# Altium schematic sheet PortaPill_MainBoard.SchDoc
size A3; DrawnBy: So-Ra Chung; SheetNumber: 1; SheetTotal: 1
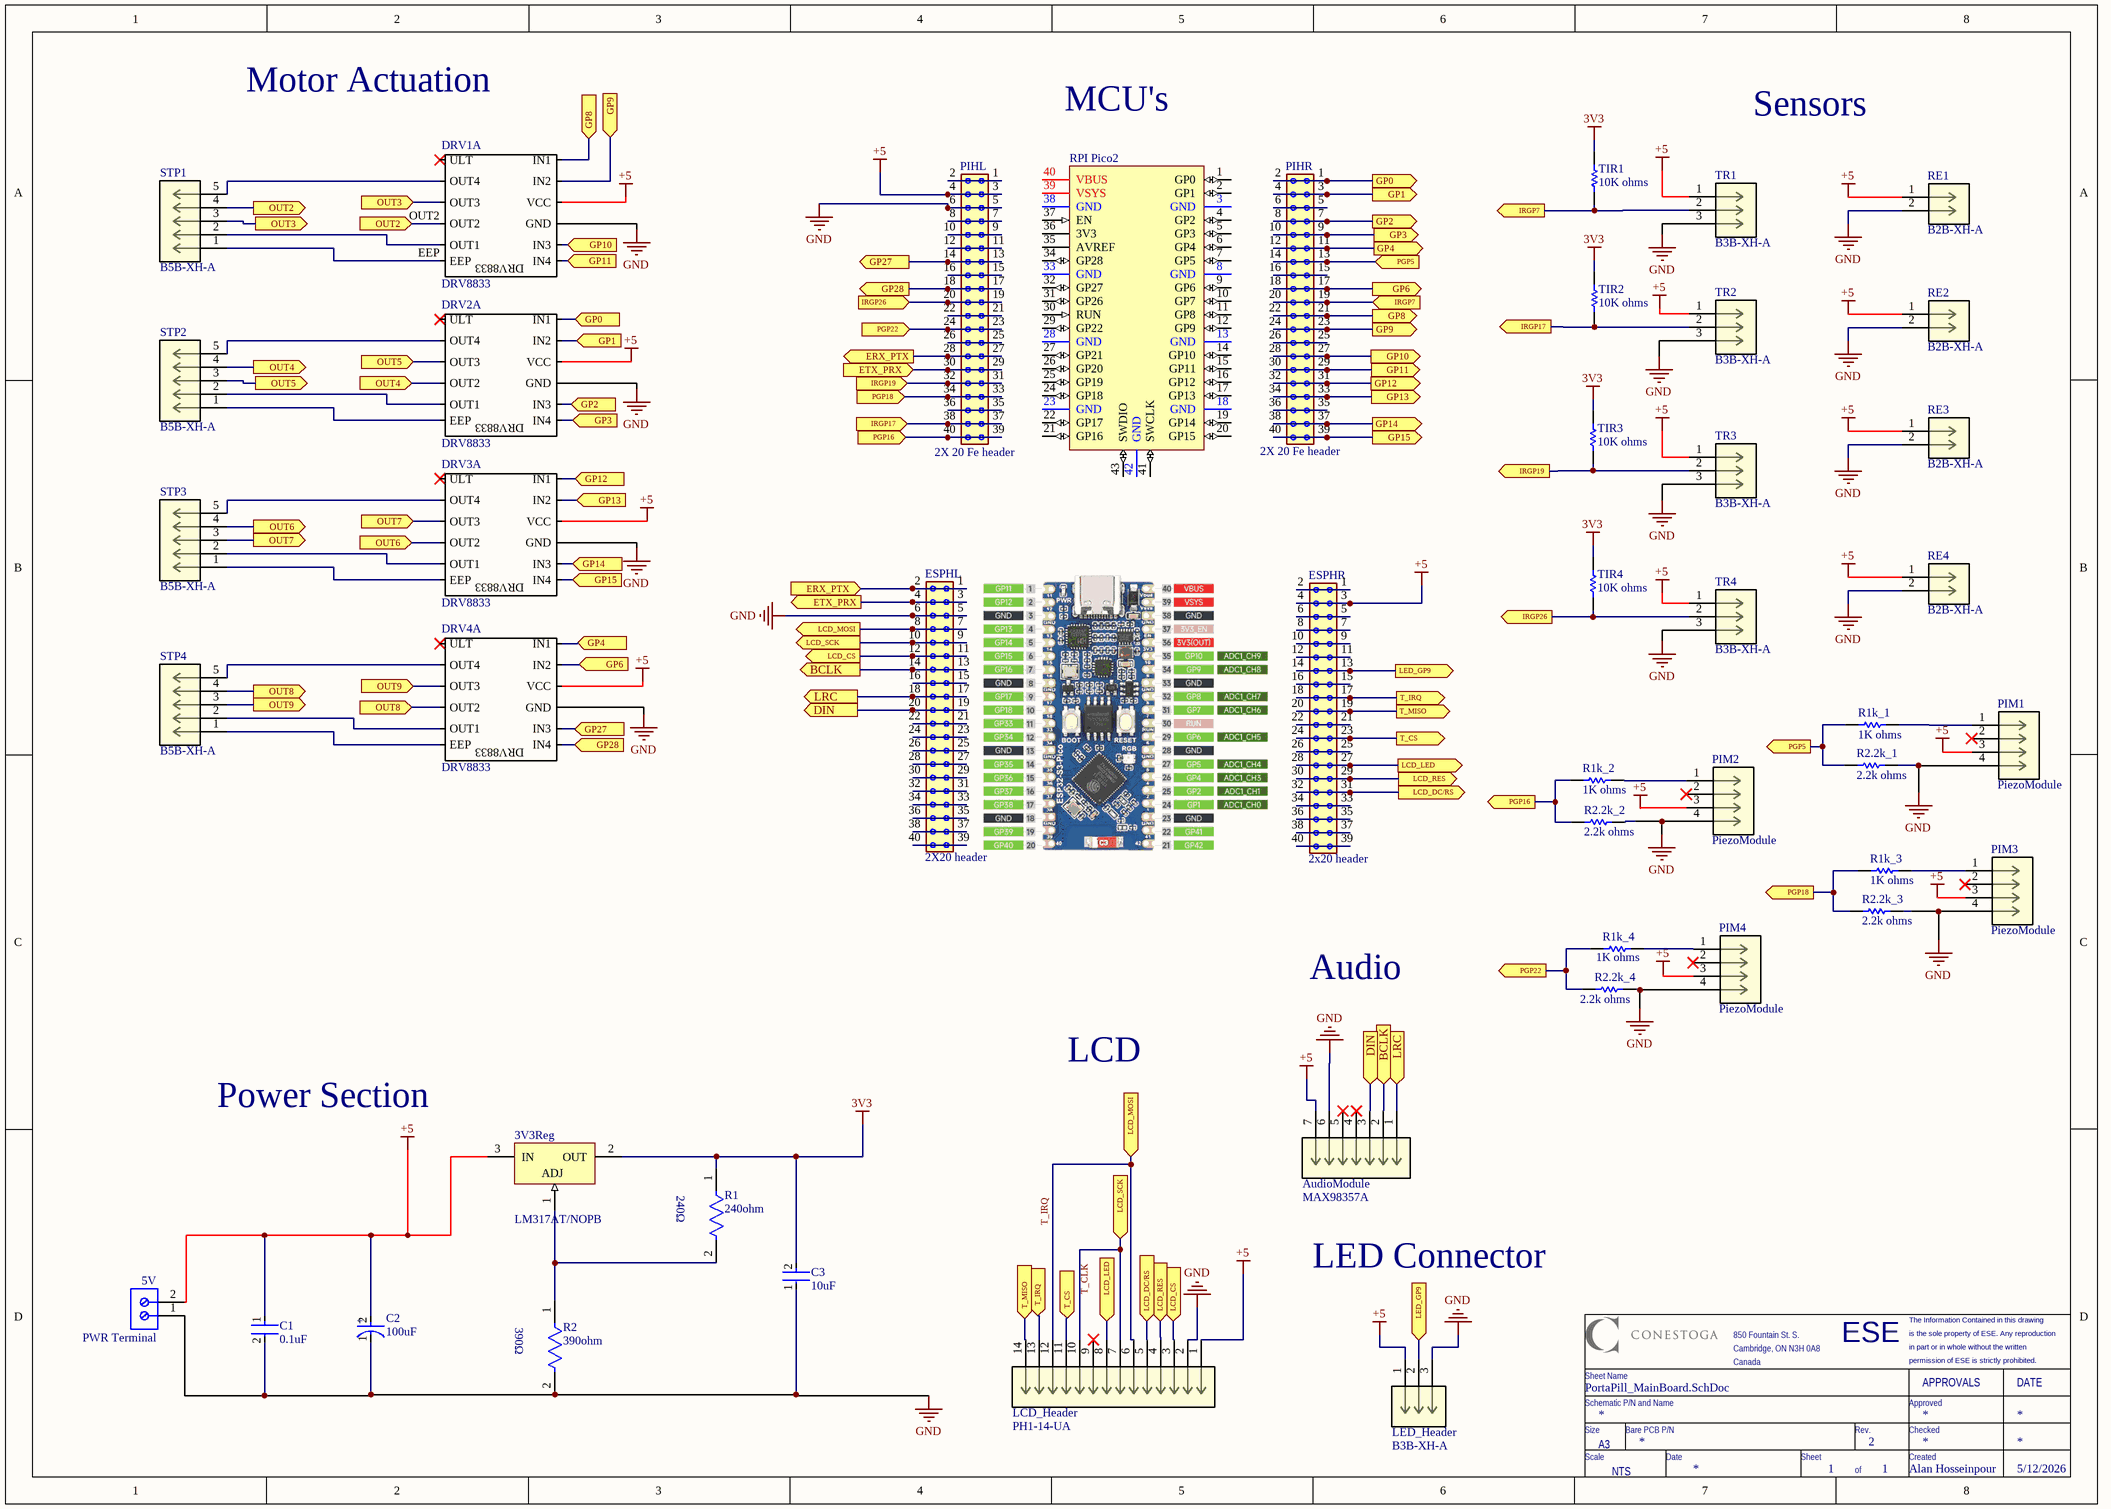
[diagram p0: PortaPill_MainBoard.SchDoc]

## Parts
3V3Reg  LM317AT/NOPB  [NDE0003A]
AudioModule  MAX98357A  [CONN07_901471107_MOL]
C1  0.1uF  [FP-C410C104M5U5TA7200-MFG]
C2  100uF  [FP-RAD-TH-D_12_5_0_5-L_25-MFG]
C3  10uF  [FP-DE2_D15_T5_F7_5_d0_6-0-MFG]
DRV1  DRV8833  [DRV8833]  (part A of 3)
DRV2  DRV8833  [DRV8833]  (part A of 3)
DRV3  DRV8833  [DRV8833]  (part A of 3)
DRV4  DRV8833  [DRV8833]  (part A of 3)
ESPHL  2X20 header  [61304021821]
ESPHR  2x20 header  [61304021821]
LCD_Header  PH1-14-UA  [CONN_PH1-14-UA_ADM]
LED_Header  B3B-XH-A  [CONN_B3B-XH-A_JST]
PIHL  2X 20 Fe header  [61304021821]
PIHR  2X 20 Fe header  [61304021821]
PIM1  PiezoModule  [CONN_PPTC041LFBN-RC_SUL]
PIM2  PiezoModule  [CONN_PPTC041LFBN-RC_SUL]
PIM3  PiezoModule  [CONN_PPTC041LFBN-RC_SUL]
PIM4  PiezoModule  [CONN_PPTC041LFBN-RC_SUL]
PWR_Terminal  5V  [691216400002]
R1  240ohm  [RR02_MFG]
R1k_1  1K ohms  [RESA60-630X240]
R1k_2  1K ohms  [RESA60-630X240]
R1k_3  1K ohms  [RESA60-630X240]
R1k_4  1K ohms  [RESA60-630X240]
R2  390ohm  [RR02_MFG]
R2.2k_1  2.2k ohms  [RESA60-630X240]
R2.2k_2  2.2k ohms  [RESA60-630X240]
R2.2k_3  2.2k ohms  [RESA60-630X240]
R2.2k_4  2.2k ohms  [RESA60-630X240]
RE1  B2B-XH-A  [CONN_B2B-XH-A_JST]
RE2  B2B-XH-A  [CONN_B2B-XH-A_JST]
RE3  B2B-XH-A  [CONN_B2B-XH-A_JST]
RE4  B2B-XH-A  [CONN_B2B-XH-A_JST]
RPI_Pico2  RPI-PICO-MOD_SM  [RPI-PICO-MOD]  (value not drawn)
STP1  B5B-XH-A  [CONN_B5B-XH-A_JST]
STP2  B5B-XH-A  [CONN_B5B-XH-A_JST]
STP3  B5B-XH-A  [CONN_B5B-XH-A_JST]
STP4  B5B-XH-A  [CONN_B5B-XH-A_JST]
TIR1  10K ohms  [RESA60-630X240]
TIR2  10K ohms  [RESA60-630X240]
TIR3  10K ohms  [RESA60-630X240]
TIR4  10K ohms  [RESA60-630X240]
TR1  B3B-XH-A  [CONN_B3B-XH-A_JST]
TR2  B3B-XH-A  [CONN_B3B-XH-A_JST]
TR3  B3B-XH-A  [CONN_B3B-XH-A_JST]
TR4  B3B-XH-A  [CONN_B3B-XH-A_JST]

## Ports
BCLK (in, see PortaPill_MainBoard[4B]), BCLK (out, see PortaPill_MainBoard[6C]), DIN (in, see PortaPill_MainBoard[4B]), DIN (out, see PortaPill_MainBoard[6C]), ERX_PTX (in, see PortaPill_MainBoard[4A]), ERX_PTX (out, see PortaPill_MainBoard[4B]), ETX_PRX (in, see PortaPill_MainBoard[4B]), ETX_PRX (out, see PortaPill_MainBoard[4A]), GP0 (in, see PortaPill_MainBoard[6A]), GP0 (out, see PortaPill_MainBoard[3A]), GP1 (in, see PortaPill_MainBoard[6A]), GP1 (out, see PortaPill_MainBoard[3A]), GP2 (in, see PortaPill_MainBoard[6A]), GP2 (out, see PortaPill_MainBoard[3B]), GP3 (in, see PortaPill_MainBoard[6A]), GP3 (out, see PortaPill_MainBoard[3B]), GP4 (in, see PortaPill_MainBoard[6A]), GP4 (out, see PortaPill_MainBoard[3B]), GP6 (in, see PortaPill_MainBoard[6A]), GP6 (out, see PortaPill_MainBoard[3B]), GP8 (in, see PortaPill_MainBoard[6A]), GP8 (out, see PortaPill_MainBoard[3A]), GP9 (in, see PortaPill_MainBoard[6A]), GP9 (out, see PortaPill_MainBoard[3A]), GP10 (in, see PortaPill_MainBoard[6A]), GP10 (out, see PortaPill_MainBoard[3A]), GP11 (in, see PortaPill_MainBoard[6A]), GP11 (out, see PortaPill_MainBoard[3A]), GP12 (in, see PortaPill_MainBoard[6B]), GP12 (out, see PortaPill_MainBoard[3B]), GP13 (in, see PortaPill_MainBoard[6B]), GP13 (out, see PortaPill_MainBoard[3B]), GP14 (in, see PortaPill_MainBoard[6B]), GP14 (out, see PortaPill_MainBoard[3B]), GP15 (in, see PortaPill_MainBoard[6B]), GP15 (out, see PortaPill_MainBoard[3B]), GP27 (in, see PortaPill_MainBoard[4A]), GP27 (out, see PortaPill_MainBoard[3B]), GP28 (in, see PortaPill_MainBoard[4A]), GP28 (out, see PortaPill_MainBoard[3B]), IRGP7 (in, see PortaPill_MainBoard[6A]), IRGP7 (out, see PortaPill_MainBoard[6A]), IRGP17 (in, see PortaPill_MainBoard[6A]), IRGP17 (out, see PortaPill_MainBoard[4B]), IRGP19 (in, see PortaPill_MainBoard[6B]), IRGP19 (out, see PortaPill_MainBoard[4B]), IRGP26 (in, see PortaPill_MainBoard[6B]), IRGP26 (out, see PortaPill_MainBoard[4A]), LCD_CS (in, see PortaPill_MainBoard[4B]), LCD_CS (out, see PortaPill_MainBoard[5D]), LCD_DC/RS (in, see PortaPill_MainBoard[6C]), LCD_DC/RS (out, see PortaPill_MainBoard[5D]), LCD_LED (in, see PortaPill_MainBoard[6C]), LCD_LED (out, see PortaPill_MainBoard[5D]), LCD_MOSI (in, see PortaPill_MainBoard[4B]), LCD_MOSI (out, see PortaPill_MainBoard[5D]), LCD_RES (in, see PortaPill_MainBoard[6C]), LCD_RES (out, see PortaPill_MainBoard[5D]), LCD_SCK (in, see PortaPill_MainBoard[4B]), LCD_SCK (out, see PortaPill_MainBoard[5D]), LED_GP9 (in, see PortaPill_MainBoard[6B]), LED_GP9 (out, see PortaPill_MainBoard[6D]), LRC (in, see PortaPill_MainBoard[4B]), LRC (out, see PortaPill_MainBoard[6C]), OUT2 (in, see PortaPill_MainBoard[1A]), OUT2 (out, see PortaPill_MainBoard[2A]), OUT3 (in, see PortaPill_MainBoard[1A]), OUT3 (out, see PortaPill_MainBoard[2A]), OUT4 (in, see PortaPill_MainBoard[1A]), OUT4 (out, see PortaPill_MainBoard[2B]), OUT5 (in, see PortaPill_MainBoard[1B]), OUT5 (out, see PortaPill_MainBoard[2A]), OUT6 (in, see PortaPill_MainBoard[1B]), OUT6 (out, see PortaPill_MainBoard[2B]), OUT7 (in, see PortaPill_MainBoard[1B]), OUT7 (out, see PortaPill_MainBoard[2B]), OUT8 (in, see PortaPill_MainBoard[1B]), OUT8 (out, see PortaPill_MainBoard[2B]), OUT9 (in, see PortaPill_MainBoard[1B]), OUT9 (out, see PortaPill_MainBoard[2B]), PGP5 (in, see PortaPill_MainBoard[7B]), PGP5 (out, see PortaPill_MainBoard[6A]), PGP16 (in, see PortaPill_MainBoard[6C]), PGP16 (out, see PortaPill_MainBoard[4B]), PGP18 (in, see PortaPill_MainBoard[7C]), PGP18 (out, see PortaPill_MainBoard[4B]), PGP22 (in, see PortaPill_MainBoard[6C]), PGP22 (out, see PortaPill_MainBoard[4A]), T_CS (in, see PortaPill_MainBoard[6B]), T_CS (out, see PortaPill_MainBoard[5D]), T_IRQ (in, see PortaPill_MainBoard[6B]), T_IRQ (out, see PortaPill_MainBoard[4D]), T_MISO (in, see PortaPill_MainBoard[6B]), T_MISO (out, see PortaPill_MainBoard[4D])

## Nets
3V3: 3V3Reg.2(OUT) C3.2 R1.1 TIR1.2 TIR2.2 TIR3.2 TIR4.2
+5: 3V3Reg.3(IN) AudioModule.7 C1.1 C2.2(A) DRV1.VCC DRV2.VCC DRV3.VCC DRV4.VCC ESPHR.3 ESPHR.4 LCD_Header.1 LED_Header.1 PIHL.3 PIHL.4 PIM1.3 PIM2.3 PIM3.3 PIM4.3 PWR_Terminal.2 RE1.1 RE2.1 RE3.1 RE4.1 TR1.1 TR2.1 TR3.1 TR4.1
GND: AudioModule.6 C1.2 C2.1(C) C3.1 DRV1.GND DRV2.GND DRV3.GND DRV4.GND ESPHL.5 ESPHL.6 LCD_Header.2 LED_Header.3 PIHL.5 PIHL.6 PIM1.4 PIM2.4 PIM3.4 PIM4.4 PWR_Terminal.1 R2.2 R2.2k_1.2 R2.2k_2.2 R2.2k_3.2 R2.2k_4.2 RE1.2 RE2.2 RE3.2 RE4.2 TR1.3 TR2.3 TR3.3 TR4.3
BCLK: AudioModule.2 ESPHL.13 ESPHL.14 ; port BCLK
DIN: AudioModule.3 ESPHL.19 ESPHL.20 ; port DIN
ERX_PTX: ESPHL.1 ESPHL.2 PIHL.27 PIHL.28 ; port ERX_PTX
ETX_PRX: ESPHL.3 ESPHL.4 PIHL.29 PIHL.30 ; port ETX_PRX
GP0: DRV2.IN1 PIHR.1 PIHR.2 ; port GP0
GP1: DRV2.IN2 PIHR.3 PIHR.4 ; port GP1
GP2: DRV2.IN3 PIHR.7 PIHR.8 ; port GP2
GP3: DRV2.IN4 PIHR.9 PIHR.10 ; port GP3
GP4: DRV4.IN1 PIHR.11 PIHR.12 ; port GP4
GP6: DRV4.IN2 PIHR.17 PIHR.18 ; port GP6
GP8: DRV1.IN1 PIHR.21 PIHR.22 ; port GP8
GP9: DRV1.IN2 PIHR.23 PIHR.24 ; port GP9
GP10: DRV1.IN3 PIHR.27 PIHR.28 ; port GP10
GP11: DRV1.IN4 PIHR.29 PIHR.30 ; port GP11
GP12: DRV3.IN1 PIHR.31 PIHR.32 ; port GP12
GP13: DRV3.IN2 PIHR.33 PIHR.34 ; port GP13
GP14: DRV3.IN3 PIHR.37 PIHR.38 ; port GP14
GP15: DRV3.IN4 PIHR.39 PIHR.40 ; port GP15
GP27: DRV4.IN3 PIHL.13 PIHL.14 ; port GP27
GP28: DRV4.IN4 PIHL.17 PIHL.18 ; port GP28
IRGP7: PIHR.19 PIHR.20 TIR1.1 TR1.2 ; port IRGP7
IRGP17: PIHL.37 PIHL.38 TIR2.1 TR2.2 ; port IRGP17
IRGP19: PIHL.31 PIHL.32 TIR3.1 TR3.2 ; port IRGP19
IRGP26: PIHL.19 PIHL.20 TIR4.1 TR4.2 ; port IRGP26
LCD_CS: ESPHL.11 ESPHL.12 LCD_Header.3 ; port LCD_CS
LCD_DC/RS: ESPHR.31 ESPHR.32 LCD_Header.5 ; port LCD_DC/RS
LCD_LED: ESPHR.27 ESPHR.28 LCD_Header.8 ; port LCD_LED
LCD_MOSI: ESPHL.7 ESPHL.8 LCD_Header.6 LCD_Header.12 ; port LCD_MOSI
LCD_RES: ESPHR.29 ESPHR.30 LCD_Header.4 ; port LCD_RES
LCD_SCK: ESPHL.9 ESPHL.10 LCD_Header.7 LCD_Header.10 ; port LCD_SCK
LED_GP9: ESPHR.13 ESPHR.14 LED_Header.2 ; port LED_GP9
LRC: AudioModule.1 ESPHL.17 ESPHL.18 ; port LRC
OUT2: DRV1.OUT2 STP1.4 ; port OUT2
OUT3: DRV1.OUT3 STP1.3 ; port OUT3
OUT4: DRV2.OUT2 STP2.4 ; port OUT4
OUT5: DRV2.OUT3 STP2.3 ; port OUT5
OUT6: DRV3.OUT2 STP3.4 ; port OUT6
OUT7: DRV3.OUT3 STP3.3 ; port OUT7
OUT8: DRV4.OUT2 STP4.4 ; port OUT8
OUT9: DRV4.OUT3 STP4.3 ; port OUT9
PGP5: PIHR.13 PIHR.14 R1k_1.1 R2.2k_1.1 ; port PGP5
PGP16: PIHL.39 PIHL.40 R1k_2.1 R2.2k_2.1 ; port PGP16
PGP18: PIHL.33 PIHL.34 R1k_3.1 R2.2k_3.1 ; port PGP18
PGP22: PIHL.23 PIHL.24 R1k_4.1 R2.2k_4.1 ; port PGP22
T_CS: ESPHR.23 ESPHR.24 LCD_Header.11 ; port T_CS
T_IRQ: ESPHR.17 ESPHR.18 LCD_Header.13 ; port T_IRQ
T_MISO: ESPHR.19 ESPHR.20 LCD_Header.14 ; port T_MISO
Net3V3Reg_1: 3V3Reg.1(ADJ) R1.2 R2.1
NetDRV1_EEP: DRV1.EEP STP1.1
NetDRV1_OUT1: DRV1.OUT1 STP1.2
NetDRV1_OUT4: DRV1.OUT4 STP1.5
NetDRV2_EEP: DRV2.EEP STP2.1
NetDRV2_OUT1: DRV2.OUT1 STP2.2
NetDRV2_OUT4: DRV2.OUT4 STP2.5
NetDRV3_EEP: DRV3.EEP STP3.1
NetDRV3_OUT1: DRV3.OUT1 STP3.2
NetDRV3_OUT4: DRV3.OUT4 STP3.5
NetDRV4_EEP: DRV4.EEP STP4.1
NetDRV4_OUT1: DRV4.OUT1 STP4.2
NetDRV4_OUT4: DRV4.OUT4 STP4.5
NetESPHL_15: ESPHL.15 ESPHL.16
NetESPHL_21: ESPHL.21 ESPHL.22
NetESPHL_23: ESPHL.23 ESPHL.24
NetESPHL_25: ESPHL.25 ESPHL.26
NetESPHL_27: ESPHL.27 ESPHL.28
NetESPHL_29: ESPHL.29 ESPHL.30
NetESPHL_31: ESPHL.31 ESPHL.32
NetESPHL_33: ESPHL.33 ESPHL.34
NetESPHL_35: ESPHL.35 ESPHL.36
NetESPHL_37: ESPHL.37 ESPHL.38
NetESPHL_39: ESPHL.39 ESPHL.40
NetESPHR_1: ESPHR.1 ESPHR.2
NetESPHR_5: ESPHR.5 ESPHR.6
NetESPHR_7: ESPHR.7 ESPHR.8
NetESPHR_9: ESPHR.9 ESPHR.10
NetESPHR_11: ESPHR.11 ESPHR.12
NetESPHR_15: ESPHR.15 ESPHR.16
NetESPHR_21: ESPHR.21 ESPHR.22
NetESPHR_25: ESPHR.25 ESPHR.26
NetESPHR_33: ESPHR.33 ESPHR.34
NetESPHR_35: ESPHR.35 ESPHR.36
NetESPHR_37: ESPHR.37 ESPHR.38
NetESPHR_39: ESPHR.39 ESPHR.40
NetPIHL_1: PIHL.1 PIHL.2
NetPIHL_7: PIHL.7 PIHL.8
NetPIHL_9: PIHL.9 PIHL.10
NetPIHL_11: PIHL.11 PIHL.12
NetPIHL_15: PIHL.15 PIHL.16
NetPIHL_21: PIHL.21 PIHL.22
NetPIHL_25: PIHL.25 PIHL.26
NetPIHL_35: PIHL.35 PIHL.36
NetPIHR_5: PIHR.5 PIHR.6
NetPIHR_15: PIHR.15 PIHR.16
NetPIHR_25: PIHR.25 PIHR.26
NetPIHR_35: PIHR.35 PIHR.36
NetPIM1_1: PIM1.1 R1k_1.2
NetPIM2_1: PIM2.1 R1k_2.2
NetPIM3_1: PIM3.1 R1k_3.2
NetPIM4_1: PIM4.1 R1k_4.2

Not connected (* = marked no-connect by the designer): AudioModule 4* 5*; DRV1 ULT*; DRV2 ULT*; DRV3 ULT*; DRV4 ULT*; LCD_Header 9*; PIM1 2*; PIM2 2*; PIM3 2*; PIM4 2*; RPI_Pico2 1(GP0) 2(GP1) 3(GND) 4(GP2) 5(GP3) 6(GP4) 7(GP5) 8(GND) 9(GP6) 10(GP7) 11(GP8) 12(GP9) 13(GND) 14(GP10) 15(GP11) 16(GP12) 17(GP13) 18(GND) 19(GP14) 20(GP15) 21(GP16) 22(GP17) 23(GND) 24(GP18) 25(GP19) 26(GP20) 27(GP21) 28(GND) 29(GP22) 30(RUN) 31(GP26) 32(GP27) 33(GND) 34(GP28) 35(AVREF) 36(3V3) 37(EN) 38(GND) 39(VSYS) 40(VBUS) 41(SWCLK) 42(GND) 43(SWDIO)

## Notes on the sheet
- Motor Actuation
- MCU's
- Sensors
- Audio
- Power Section
- LCD
- LED Connector
- ESE
- is the sole property of ESE. Any reproduction
- The Information Contained in this drawing
- Schematic P/N and Name
- Sheet Name
- 850 Fountain St. S.
- Cambridge, ON N3H 0A8
- Canada
- Approved
- in part or in whole without the written
- permission of ESE is strictly prohibited.
- APPROVALS
- DATE
- Size
- Scale
- A3
- NTS
- Bare PCB P/N
- Date
- Sheet
- Rev.
- 2
- Checked
- Created
- of
- Alan Hosseinpour
- 5/12/2026
- Labels drawn without touching a wire or pin: T_CLK, T_IRQ
- (in symbol CMP-05427-002077-1) +

## Library data of the parts
3V3Reg = CMP-0062-02452-3: 3-Terminal Adjustable Regulator, 3-pin TO-220, Pb-Free; Manufacturer: Texas Instruments; CompType: LDO IC; PackageTopMarking: NSUZXYTTE#*LM317AT P+; PowerWise: N; ComponentLink1URL: http://www.ti.com/general/docs/lit/getliterature.tsp?genericPartNumber=LM317-N&fileType=pdf; RoHS: Y; PackageDescription: TO-220, Molded, 3 Lead, Straight; ComponentLink1Description: Datasheet URL; PackageReference: NDE0003A; PinCount: 3
AudioModule = 901471107: C-Grid III PC Board Connector, Single Row, Vertical, 7 Circuits, Tin (Sn) Plating; Manufacturer_Name: Molex; Copyright: Copyright (C) 2026 Ultra Librarian. All rights reserved.; Manufacturer_Part_Number: 901471107; RefDes: RefDes; Type: Type
C1 = CMP-03020-034640-1: C410C104M5U5TA7200 / CAP CER 0.1UF 50V Z5U AXIAL; Capacitance: 100nF; Tolerance: 20%; Lead Diameter: 0.51mm; Dissipation Factor: 4%; Lead Length: 25.4mm; Mount: Through Hole; Length: 4.32mm; Lead Free: Lead Free; Number of Pins: 2; Case/Package: Axial; Max Operating Temperature: 85°C; RoHS Compliant: Yes; Dielectric: Z5U; Min Operating Temperature: 10°C; Series: Aximax 400; Termination: Axial; Radiation Hardening: No; Voltage Rating (DC): 50V; REACH SVHC: No SVHC; Construction: AXIAL; Package Quantity: 5000; Packaging: Tape and Reel; Voltage Rating: 50V
C2 = CMP-05427-002077-1: Aluminum Electrolytic Capacitors (Radial Lead Type) 100uF ±20% 160V / EEUED2C101; Lead Diameter: 0.6mm; Ripple Current: 1.17A; Dissipation Factor: 0.15%; Dielectric Material: Aluminium; Life (Hours): 10000Hour; Min Operating Temperature: -25°C; Diameter: 12.5mm; Series: ED; RoHS Compliant: Yes; Height - Seated (Max): 0.984inch; Capacitance: 100uF; Length: 25mm; Radiation Hardening: No; Voltage Rating: 160V; Height: 25mm; REACH SVHC: No SVHC; Voltage: 160V; Packaging: Bulk; Voltage Rating (DC): 160V; Termination: Radial; Package Quantity: 200; Tolerance: 20%; Max Operating Temperature: 105°C; Lead Free: Lead Free; Mount: Through Hole; Case/Package: Radial; Lead Pitch: 5mm; Contact Plating: Tin; Construction: RADIAL
C3 = CMP-06035-046229-1: Cap Ceramic Disc 10000pF 20% 250VAC Thru-Hole 15.0x5.0x7.5 Bulk / DE2E3SA103MJ3BT02F
DRV1-DRV4 = DRV8833: Motor Driver; pin to pad: EEP>12 GND>3 IN1>6 IN2>5 IN3>2 IN4>1 OUT1>11 OUT2>10 OUT3>9 OUT4>8 ULT>7 VCC>4
ESPHL ESPHR PIHL PIHR = 6130XX21821_61304021821: 40 Position Receptacle Connector 0.100 (2.54mm) Through Hole Gold; MF: WÃ¼rth Elektronik; SnapEDA_Link: https://www.snapeda.com/parts/61304021821/W%25C3%25BCrth+Elektronik+Midcom/view-part/?ref=snap; Package: None; Value: *; MP: 61304021821; Check_prices: https://www.snapeda.com/parts/61304021821/W%25C3%25BCrth+Elektronik+Midcom/view-part/?ref=eda
LCD_Header = PH1-14-UA: Description; Manufacturer_Name: ADAM TECHNOLOGIES INC; Type: Headers, Male Pins; Copyright: Copyright (C) 2025 Ultra Librarian. All rights reserved.; Manufacturer_Part_Number: PH1-14-UA; RefDes: RefDes
LED_Header TR1-TR4 = B3B-XH-A: Description; Manufacturer_Name: JST; Copyright: Copyright (C) 2026 Ultra Librarian. All rights reserved.; Manufacturer_Part_Number: B3B-XH-A; RefDes: RefDes; Type: Type
PIM1-PIM4 = PPTC041LFBN-RC: Description; Manufacturer_Name: Sullins; Copyright: Copyright (C) 2026 Ultra Librarian. All rights reserved.; Manufacturer_Part_Number: PPTC041LFBN-RC; RefDes: RefDes; Type: Type
PWR_Terminal = CMP-03913-78871171-2: Terminal Block, Wtb, 2Way, 30-12Awg Rohs Compliant: Yes; Packaging: Box; Number of Pins: 2; Lead Pitch: 7.62mm
R1 = CMP-06573-42564537-1: Fixed Resistor, Metal Film, 2W, 240ohm, 500V, 5% +/-Tol, 300ppm/Cel, Through Hole Mount; Lead Diameter: 800µm; Lead Length: 30mm; Resistance: 240Ω; Number of Resistors: 1; Temperature Coefficient: 300ppm/°C; Introduction Date: 2008-09-01; Packaging: Tape & Box (TB); Lifecycle Status: Production; RoHS: Compliant; Number of Terminations: 2; Number of Terminals: 2; Max Operating Temperature: 235°C; Composition: Metal Film; ComponentLink2Description: Datasheet URL; Power Rating: 2W; HelpURL: https://www.te.com/commerce/DocumentDelivery/DDEController?Action=srchrtrv&DocNm=3-1773449-2&DocType=Data%20Sheet&DocLang=English&DocFormat=pdf&PartCntxt=1879353-3; ComponentLink1Description: Manufacturer's Website; ELV: Compliant; Max Power Dissipation: 2W; Operating Supply Voltage: 500V; Length: 9mm; Termination: Axial; REACH SVHC: Yes; Mount: Axial, Through Hole; Tolerance: 5%; Diameter: 3.5mm; Voltage Rating: 500V; Min Operating Temperature: -55°C; Case/Package: Axial; Radiation Hardening: No; ComponentLink1URL: http://www.te.com/; Working Voltage: 500V; China RoHS: Compliant; ComponentLink2URL: https://www.te.com/commerce/DocumentDelivery/DDEController?Action=srchrtrv&DocNm=3-1773449-2&DocType=Data%20Sheet&DocLang=English&DocFormat=pdf&PartCntxt=1879353-3
R1k_1-R1k_4 R2.2k_1-R2.2k_4 TIR1-TIR4 = CMP-1659-00075-1: Axial Resistor, 1 KOhm, +/- 1%, 250 mW, -55 to 155 degC, 2-Pin THD, RoHS, Bulk; Voltage Rating: 250 V; Resistance: 10 kohm; Power Rating: 250 mW; ComponentLink2Description: Datasheet; RoHSCompliant: true; PackageReference: MFR-25; Case\Package: Axial; Max Operating Temperature: 155 degC; DatasheetVersion: Apr-13; Tolerance: 1%; ComponentLink1URL: http://www.yageo.com/; Length: 0.248 inch; ComponentLink2URL: http://www.yageo.com/documents/recent/Yageo%20LR_MFR_2013.pdf; Packaging: Bulk; Package Quantity: 200; PackageDescription: 2-Pin Axial Lead, Dia 2.4 mm, Body Length 6.3 mm; Min Operating Temperature: -55 degC; ComponentLink1Description: Manufacturer URL
R2 = CMP-06573-42564537-1: Fixed Resistor, Metal Film, 2W, 240ohm, 500V, 5% +/-Tol, 300ppm/Cel, Through Hole Mount; Lead Diameter: 800µm; Lead Length: 30mm; Resistance: 390Ω; Number of Resistors: 1; Temperature Coefficient: 300ppm/°C; Introduction Date: 2008-09-01; Packaging: Tape & Box (TB); Lifecycle Status: Production; RoHS: Compliant; Number of Terminations: 2; Number of Terminals: 2; Max Operating Temperature: 235°C; Composition: Metal Film; ComponentLink2Description: Datasheet URL; Power Rating: 2W; HelpURL: https://www.te.com/commerce/DocumentDelivery/DDEController?Action=srchrtrv&DocNm=3-1773449-2&DocType=Data%20Sheet&DocLang=English&DocFormat=pdf&PartCntxt=1879353-3; ComponentLink1Description: Manufacturer's Website; ELV: Compliant; Max Power Dissipation: 2W; Operating Supply Voltage: 500V; Length: 9mm; Termination: Axial; REACH SVHC: Yes; Mount: Axial, Through Hole; Tolerance: 5%; Diameter: 3.5mm; Voltage Rating: 500V; Min Operating Temperature: -55°C; Case/Package: Axial; Radiation Hardening: No; ComponentLink1URL: http://www.te.com/; Working Voltage: 500V; China RoHS: Compliant; ComponentLink2URL: https://www.te.com/commerce/DocumentDelivery/DDEController?Action=srchrtrv&DocNm=3-1773449-2&DocType=Data%20Sheet&DocLang=English&DocFormat=pdf&PartCntxt=1879353-3
RE1-RE4 = B2B-XH-A: Description; Manufacturer_Name: JST; Copyright: Copyright (C) 2026 Ultra Librarian. All rights reserved.; Manufacturer_Part_Number: B2B-XH-A; RefDes: RefDes; Type: Type
RPI_Pico2 = RPI-PICO-MOD_SM: RASPBERRY PI PICO RP2040 BOARD NO TEST PADS; Manufacturer: Raspberry Pi Foundation; Manufacturer Part No: SC0915; Mounting Technology: SMT; Supplier: DigiKey; Supplier Part No: 2648-SC0915CT-ND; Supplier Link: https://www.digikey.com/en/products/detail/raspberry-pi/SC0915/13684020
STP1-STP4 = B5B-XH-A: Description; Manufacturer_Name: JST; Copyright: Copyright (C) 2026 Ultra Librarian. All rights reserved.; Manufacturer_Part_Number: B5B-XH-A; RefDes: RefDes; Type: Type